# Altium schematic sheet APA102.SchDoc
size A
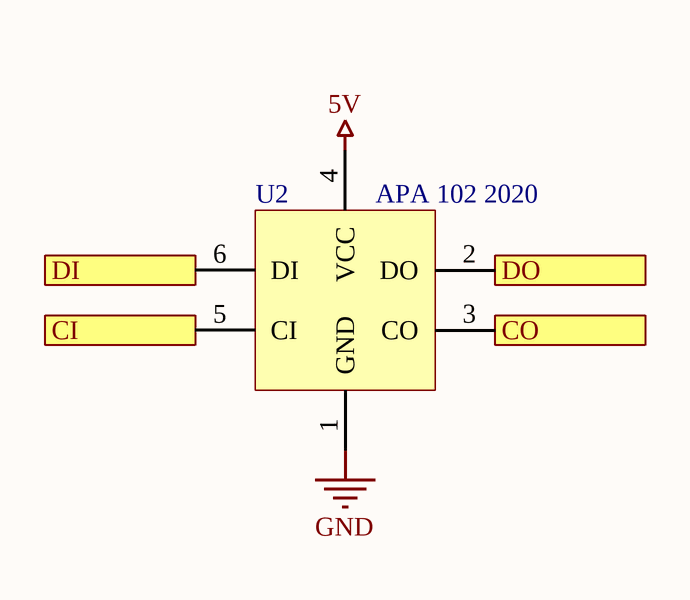
[diagram p0: APA102.SchDoc]

## Parts
U2  APA 102 2020  [LED_APA-102-1515]

## Ports
CI (in), CO (out), DI (in), DO (out)

## Nets
5V: U2.4(VCC)
GND: U2.1(GND)
CI: U2.5(CI) ; port CI
CO: U2.3(CO) ; port CO
DI: U2.6(DI) ; port DI
DO: U2.2(DO) ; port DO

## Library data of the parts
U2 = APA-102-1515: 8-pin type LED three-color RGB Dimming control; MP: APA-102-2020-256-8; MF: iPixel LED Light Co.; Value: *; SnapEDA_Link: https://www.snapeda.com/parts/APA-102-2020-256-8/iPixel%20LED%20Light%20Co./view-part/698331/?ref=snap; Availability: Unavailable; Package: SMD-8 iPixel LED Light Co.; Price: None